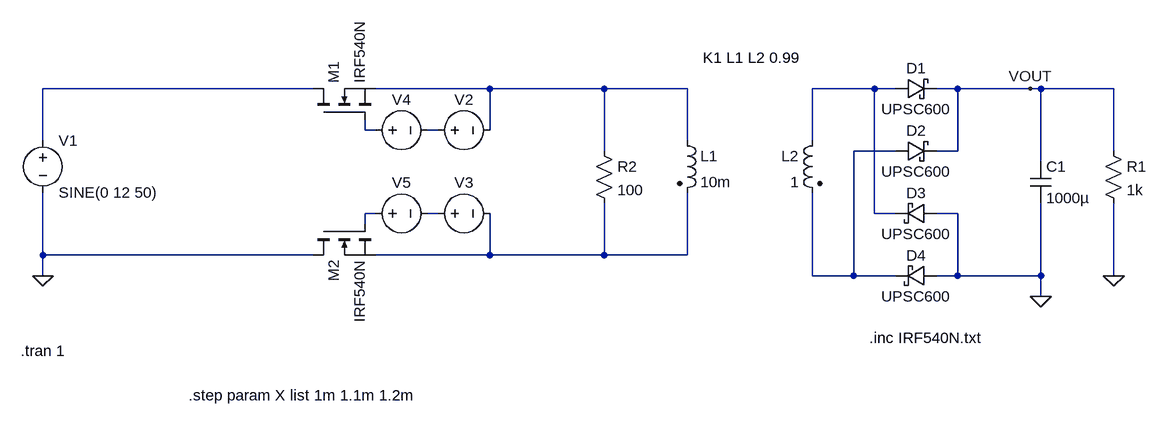
[diagram p0: schematic HVPS.asc]
HVPS.asc, the LTspice schematic file:
Version 4
SHEET 1 1620 680
WIRE 320 -192 -96 -192
WIRE 592 -192 416 -192
WIRE 768 -192 592 -192
WIRE 896 -192 768 -192
WIRE 1184 -192 1088 -192
WIRE 1216 -192 1184 -192
WIRE 1312 -192 1280 -192
WIRE 1424 -192 1312 -192
WIRE 1440 -192 1424 -192
WIRE 1552 -192 1440 -192
WIRE 400 -128 400 -144
WIRE 416 -128 400 -128
WIRE 512 -128 496 -128
WIRE 592 -128 592 -192
WIRE -96 -112 -96 -192
WIRE 896 -112 896 -192
WIRE 1088 -112 1088 -192
WIRE 768 -96 768 -192
WIRE 1216 -96 1152 -96
WIRE 1312 -96 1312 -192
WIRE 1312 -96 1280 -96
WIRE 1552 -96 1552 -192
WIRE 1440 -80 1440 -192
WIRE 416 0 400 0
WIRE 512 0 496 0
WIRE 1184 0 1184 -192
WIRE 1216 0 1184 0
WIRE 1312 0 1280 0
WIRE 400 16 400 0
WIRE -96 64 -96 -32
WIRE 320 64 -96 64
WIRE 592 64 592 0
WIRE 592 64 416 64
WIRE 768 64 768 -16
WIRE 768 64 592 64
WIRE 896 64 896 -32
WIRE 896 64 768 64
WIRE -96 96 -96 64
WIRE 1088 96 1088 -32
WIRE 1152 96 1152 -96
WIRE 1152 96 1088 96
WIRE 1216 96 1152 96
WIRE 1312 96 1312 0
WIRE 1312 96 1280 96
WIRE 1440 96 1440 -16
WIRE 1440 96 1312 96
WIRE 1552 96 1552 -16
WIRE 1440 128 1440 96
FLAG -96 96 0
FLAG 1440 128 0
FLAG 1424 -192 VOUT
FLAG 1552 96 0
SYMBOL nmos 320 -144 R270
SYMATTR InstName M1
SYMATTR Value IRF540N
SYMATTR Prefix X
SYMBOL ind2 880 -128 R0
SYMATTR InstName L1
SYMATTR Value 10m
SYMATTR Type ind
SYMBOL nmos 320 16 M90
SYMATTR InstName M2
SYMATTR Value IRF540N
SYMATTR Prefix X
SYMBOL ind2 1104 -128 M0
SYMATTR InstName L2
SYMATTR Value 1
SYMATTR Type ind
SYMBOL voltage -96 -128 R0
WINDOW 123 0 0 Left 0
WINDOW 39 0 0 Left 0
SYMATTR InstName V1
SYMATTR Value SINE(0 12 50)
SYMBOL res 752 -112 R0
SYMATTR InstName R2
SYMATTR Value 100
SYMBOL voltage 496 -128 M90
WINDOW 0 -32 56 VBottom 2
WINDOW 3 32 56 Invisible 2
WINDOW 123 0 0 Left 0
WINDOW 39 0 0 Left 0
SYMATTR InstName V2
SYMATTR Value PULSE(-5 15 0 1n 1n {X} 20m)
SYMBOL voltage 496 0 M90
WINDOW 0 -32 56 VBottom 2
WINDOW 3 32 56 Invisible 2
WINDOW 123 0 0 Left 0
WINDOW 39 0 0 Left 0
SYMATTR InstName V3
SYMATTR Value PULSE(-5 15 0 1n 1n {X} 20m)
SYMBOL voltage 400 -128 M90
WINDOW 0 -32 56 VBottom 2
WINDOW 3 32 56 Invisible 2
WINDOW 123 0 0 Left 0
WINDOW 39 0 0 Left 0
SYMATTR InstName V4
SYMATTR Value PULSE(-5 15 10m 1n 1n {X} 20m)
SYMBOL voltage 400 0 M90
WINDOW 0 -32 56 VBottom 2
WINDOW 3 32 56 Invisible 2
WINDOW 123 0 0 Left 0
WINDOW 39 0 0 Left 0
SYMATTR InstName V5
SYMATTR Value PULSE(-5 15 10m 1n 1n {X} 20m)
SYMBOL cap 1424 -80 R0
SYMATTR InstName C1
SYMATTR Value 1000µ
SYMBOL schottky 1216 -176 R270
WINDOW 0 32 32 VTop 2
WINDOW 3 0 32 VBottom 2
SYMATTR InstName D1
SYMATTR Value UPSC600
SYMATTR Description Diode
SYMATTR Type diode
SYMBOL schottky 1216 -80 R270
WINDOW 0 32 32 VTop 2
WINDOW 3 0 32 VBottom 2
SYMATTR InstName D2
SYMATTR Value UPSC600
SYMATTR Description Diode
SYMATTR Type diode
SYMBOL schottky 1280 -16 R90
WINDOW 0 0 32 VBottom 2
WINDOW 3 32 32 VTop 2
SYMATTR InstName D3
SYMATTR Value UPSC600
SYMATTR Description Diode
SYMATTR Type diode
SYMBOL schottky 1280 80 R90
WINDOW 0 0 32 VBottom 2
WINDOW 3 32 32 VTop 2
SYMATTR InstName D4
SYMATTR Value UPSC600
SYMATTR Description Diode
SYMATTR Type diode
SYMBOL res 1536 -112 R0
SYMATTR InstName R1
SYMATTR Value 1k
TEXT 1176 192 Left 2 !.inc IRF540N.txt
TEXT 920 -240 Left 2 !K1 L1 L2 0.99
TEXT -130 212 Left 2 !.tran 1
TEXT 128 280 Left 2 !.step param X list 1m 1.1m 1.2m

The netlist it stands for:
* HVPS.asc
XM1 N001 N004 N002 IRF540N  ; pins D G S
L1 N002 N009 10m
XM2 0 N007 N009 IRF540N  ; pins D G S
L2 N003 N006 1
V1 N001 0 SINE(0 12 50)
R2 N002 N009 100
V2 N005 N002 PULSE(-5 15 0 1n 1n {X} 20m)
V3 N008 N009 PULSE(-5 15 0 1n 1n {X} 20m)
V4 N004 N005 PULSE(-5 15 10m 1n 1n {X} 20m)
V5 N007 N008 PULSE(-5 15 10m 1n 1n {X} 20m)
C1 VOUT 0 1000µ
D1 N003 VOUT UPSC600
D2 N006 VOUT UPSC600
D3 0 N003 UPSC600
D4 0 N006 UPSC600
R1 VOUT 0 1k
.model D D
.lib standard.dio
.inc IRF540N.txt
K1 L1 L2 0.99
.tran 1
.step param X list 1m 1.1m 1.2m
.backanno
.end